# Altium schematic sheet NRF24L01.SchDoc
size A4
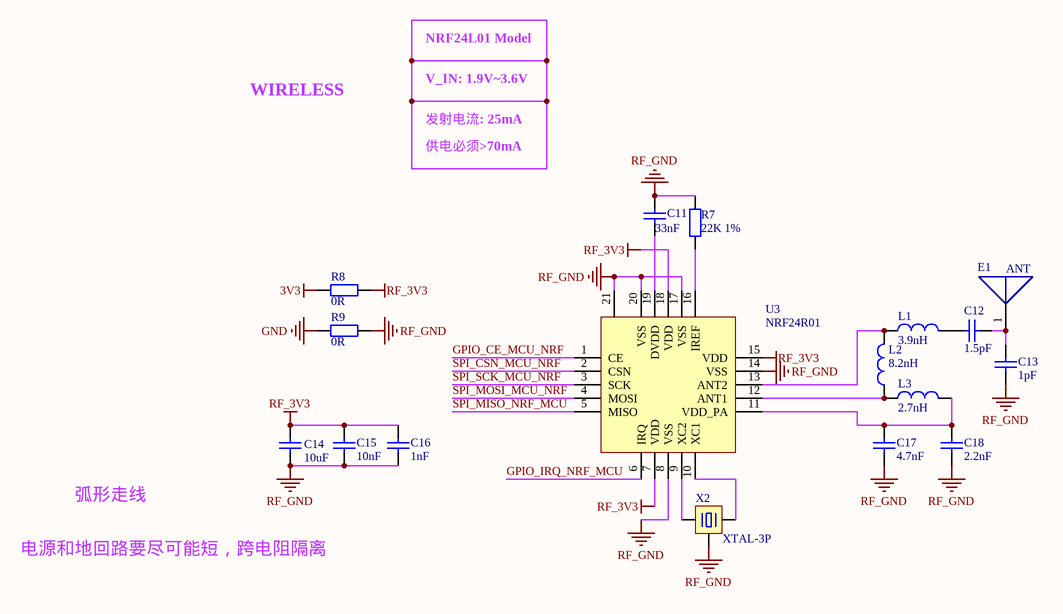
[diagram p0: NRF24L01.SchDoc]

## Parts
C11  33nF  [CAP-0402-M]
C12  1.5pF  [Cap-0402-M]
C13  1pF  [Cap-0402-M]
C14  10uF  [Cap-0603-M]
C15  10nF  [CAP-0402-M]
C16  1nF  [CAP-0402-M]
C17  4.7nF  [Cap-0402-M]
C18  2.2nF  [Cap-0402-M]
E1  ANT  [AN2051-245]
L1  3.9nH  [L-0402]
L2  8.2nH  [L-0402]
L3  2.7nH  [L-0402]
R7  22K 1%  [Res-0402-M]
R8  0R  [Res-0402-M]
R9  0R  [Res-0402-M]
U3  NRF24R01  [QFN20 4x4]
X2  XTAL-3P  [OSC 3213-3P]

## Nets
3V3: R8.1
GND: R9.1
RF_3V3: C14.2 C15.2 C16.2 R8.2 U3.7(VDD) U3.15(VDD) U3.18(VDD)
RF_GND: C11.1 C13.1 C14.1 C15.1 C16.1 C17.1 C18.1 R7.1 R9.2 U3.8(VSS) U3.14(VSS) U3.17(VSS) U3.20(VSS) U3.21 X2.2
GPIO_CE_MCU_NRF: U3.1(CE)
GPIO_IRQ_NRF_MCU: U3.6(IRQ)
SPI_CSN_MCU_NRF: U3.2(CSN)
SPI_MISO_NRF_MCU: U3.5(MISO)
SPI_MOSI_MCU_NRF: U3.4(MOSI)
SPI_SCK_MCU_NRF: U3.3(SCK)
NetC11_2: C11.2 U3.19(DVDD)
NetC12_1: C12.1 L1.2
NetC12_2: C12.2 C13.2 E1.1
NetC17_2: C17.2 C18.2 L3.2 U3.11(VDD_PA)
NetL1_1: L1.1 L2.2 U3.13(ANT2)
NetL2_1: L2.1 L3.1 U3.12(ANT1)
NetR7_2: R7.2 U3.16(IREF)
NetU3_9: U3.9(XC2) X2.1
NetU3_10: U3.10(XC1) X2.3

## Notes on the sheet
- NRF24L01 Model
- WIRELESS
- V_IN: 1.9V~3.6V
- 发射电流: 25mA
- 供电必须>70mA
- 弧形走线
- 电源和地回路要尽可能短，跨电阻隔离

## Library data of the parts
C11-C18 = CAP: 贴片陶瓷电容
L1-L3 = INDUCTOR: 贴片电感
R7-R9 = RES: 贴片电阻
U3 = NRF24R01: 2.4G无线
X2 = XTAL-3P: 3脚无源晶振带电容
E1 = ANT: Published: 12-August-2017; Publisher: mazhongwei; PackageReference: R_1206